# EAGLE design posboard (EAGLE 7.1.0)
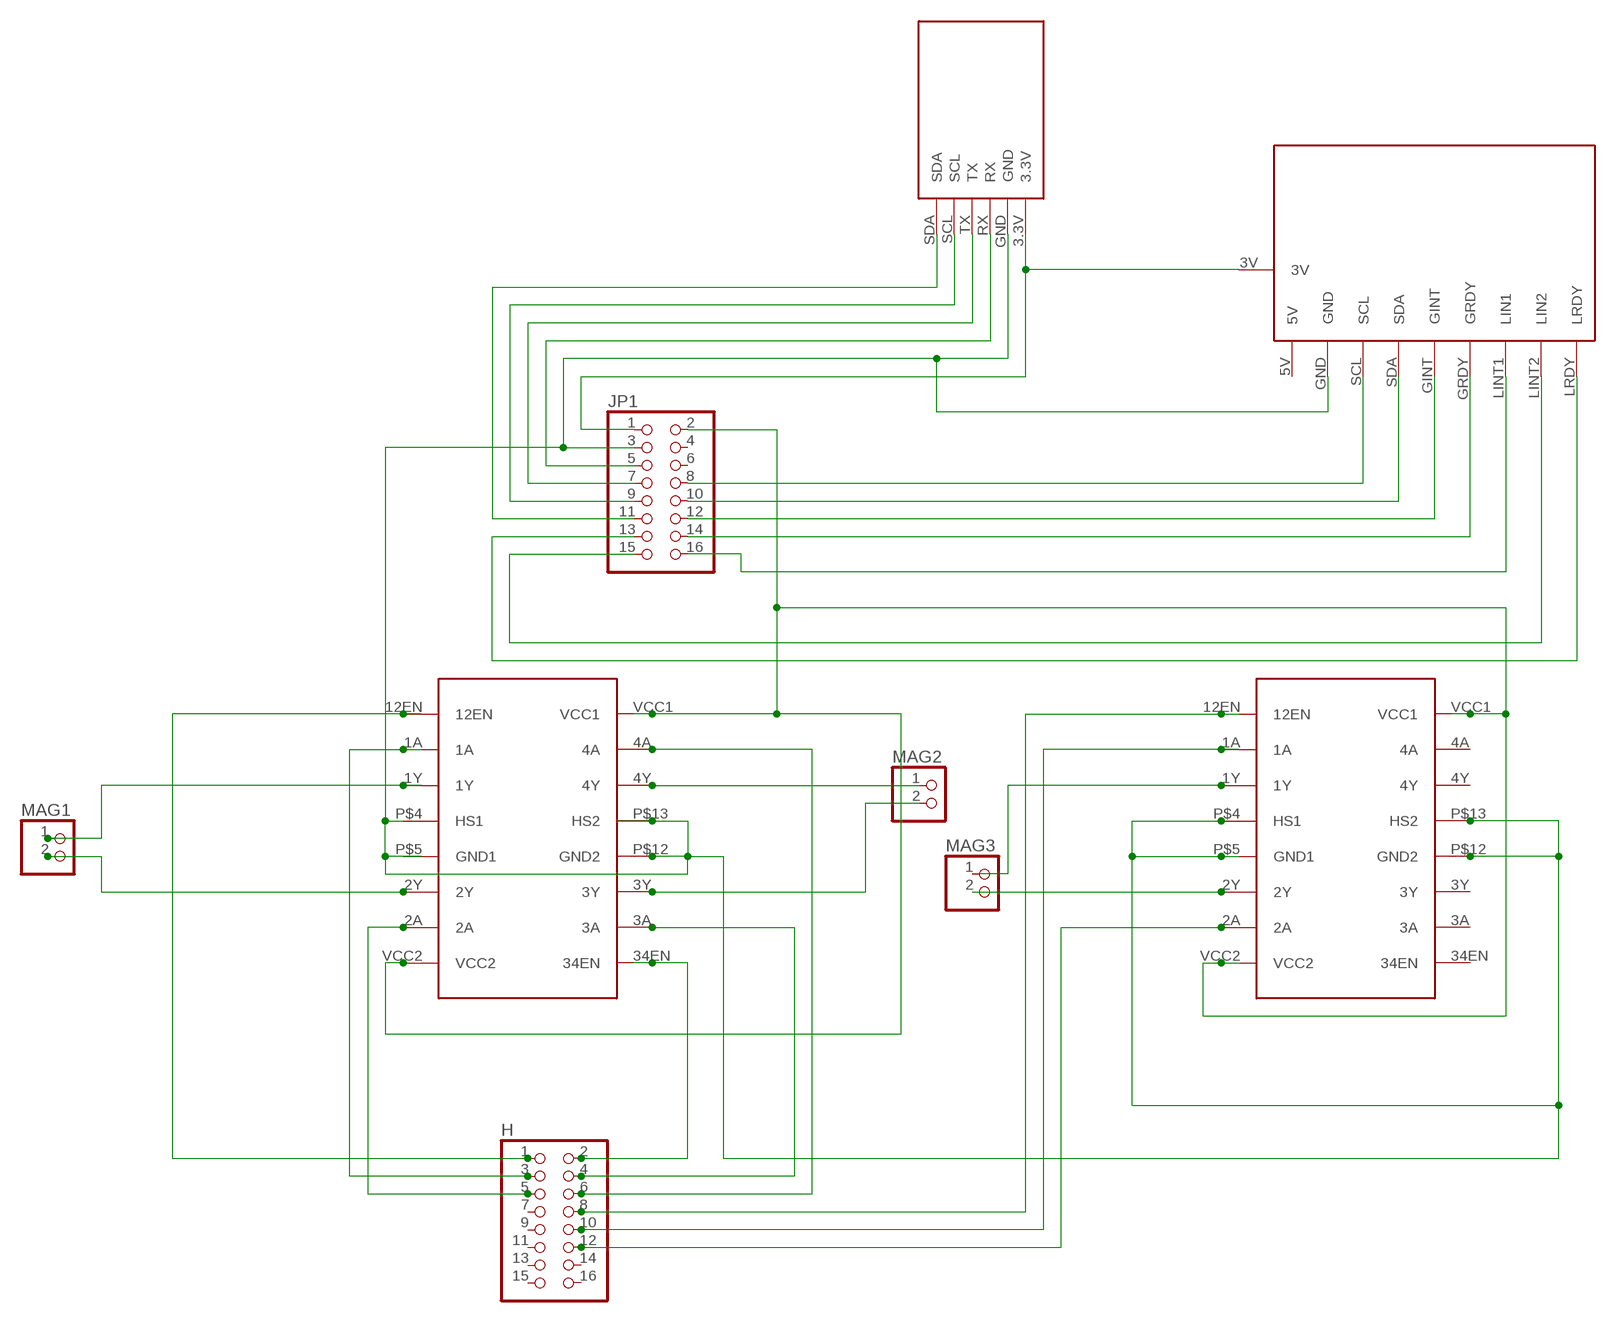
[diagram p0: schematic, sheet 1]

## Parts
H  PINHD-2X8  [2X08]
JP1  PINHD-2X8  [2X08]
MAG1  PINHD-1X2  [1X02]
MAG2  PINHD-1X2  [1X02]
MAG3  PINHD-1X2  [1X02]
U$1  GPS  [GPS]
U$2  IMU  [IMU]
U$3  HBRIDGE  [HBRIDGE]
U$4  HBRIDGE  [HBRIDGE]

## Nets
N$1: JP1.1 U$1.3.3V U$2.3V
N$2: JP1.3 U$1.GND U$2.GND U$3.P$4(HS1) U$3.P$12(GND2) U$3.P$13(HS2) U$4.P$4(HS1) U$4.P$5(GND1) U$4.P$12(GND2) U$4.P$13(HS2)
N$3: JP1.5 U$1.RX
N$4: JP1.7 U$1.TX
N$5: JP1.9 U$1.SCL
N$6: JP1.11 U$1.SDA
N$7: H.1 U$3.12EN
N$8: JP1.13 U$2.LRDY
N$9: JP1.15 U$2.LINT2(LIN2)
N$10: JP1.16 U$2.LINT1(LIN1)
N$11: JP1.14 U$2.GRDY
N$12: JP1.12 U$2.GINT
N$13: JP1.10 U$2.SDA
N$14: JP1.8 U$2.SCL
N$15: H.3 U$3.1A
N$16: JP1.2 U$3.VCC1 U$3.VCC2 U$4.VCC1 U$4.VCC2
N$17: H.2 U$3.34EN
N$18: H.4 U$3.3A
N$19: H.5 U$3.2A
N$20: H.8 U$4.12EN
N$21: H.10 U$4.1A
N$22: H.6 U$3.4A
N$23: H.12 U$4.2A
N$24: MAG1.1 U$3.1Y
N$25: MAG1.2 U$3.2Y
N$26: MAG2.1 U$3.4Y
N$27: MAG2.2 U$3.3Y
N$28: MAG3.1 U$4.1Y
N$29: MAG3.2 U$4.2Y
Unconnected: H.7 H.9 H.11 H.13 H.14 H.15 H.16 JP1.4 JP1.6 U$2.5V U$3.P$5(GND1) U$4.3A U$4.3Y U$4.4A U$4.4Y U$4.34EN

## Library data of the parts
H JP1 = pinhead:PINHD-2X8: PIN HEADER
MAG1-MAG3 = pinhead:PINHD-1X2: PIN HEADER
U$1 = gps:GPS
U$2 = imu:IMU
U$3 U$4 = hbridge:HBRIDGE

## Board
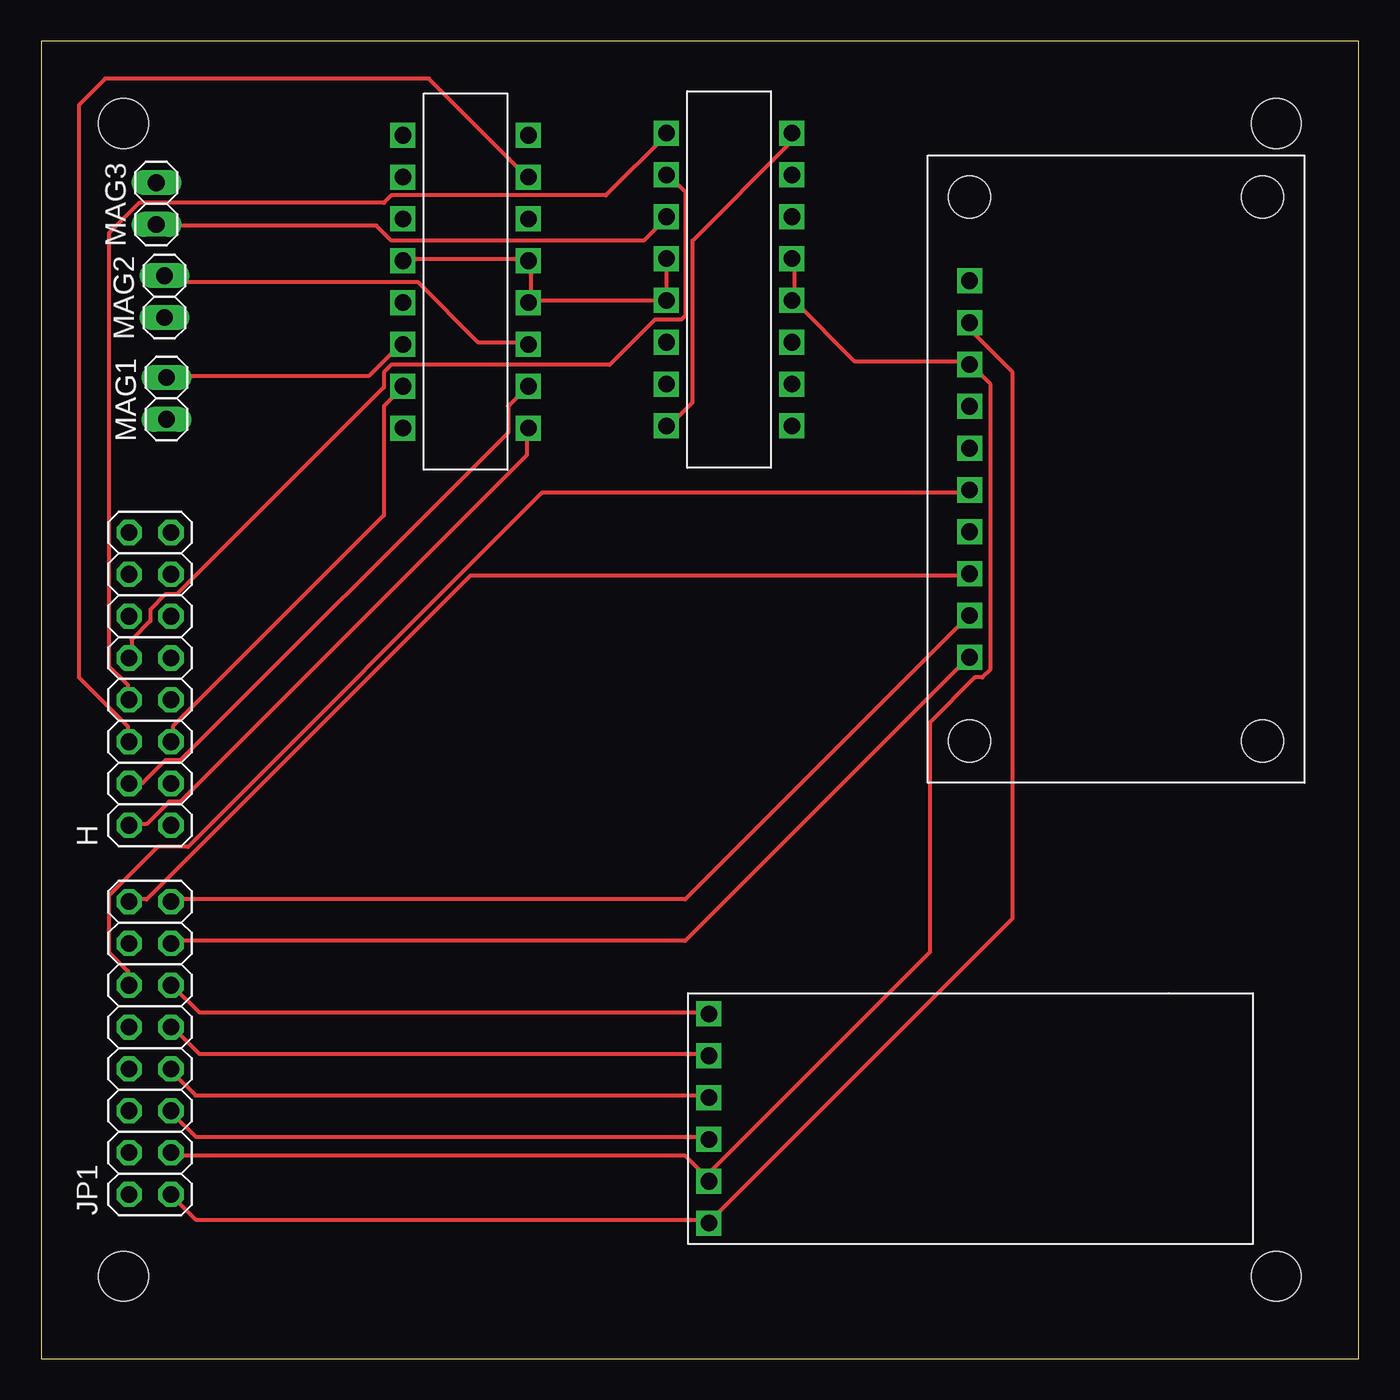
[diagram p1: board, top side]
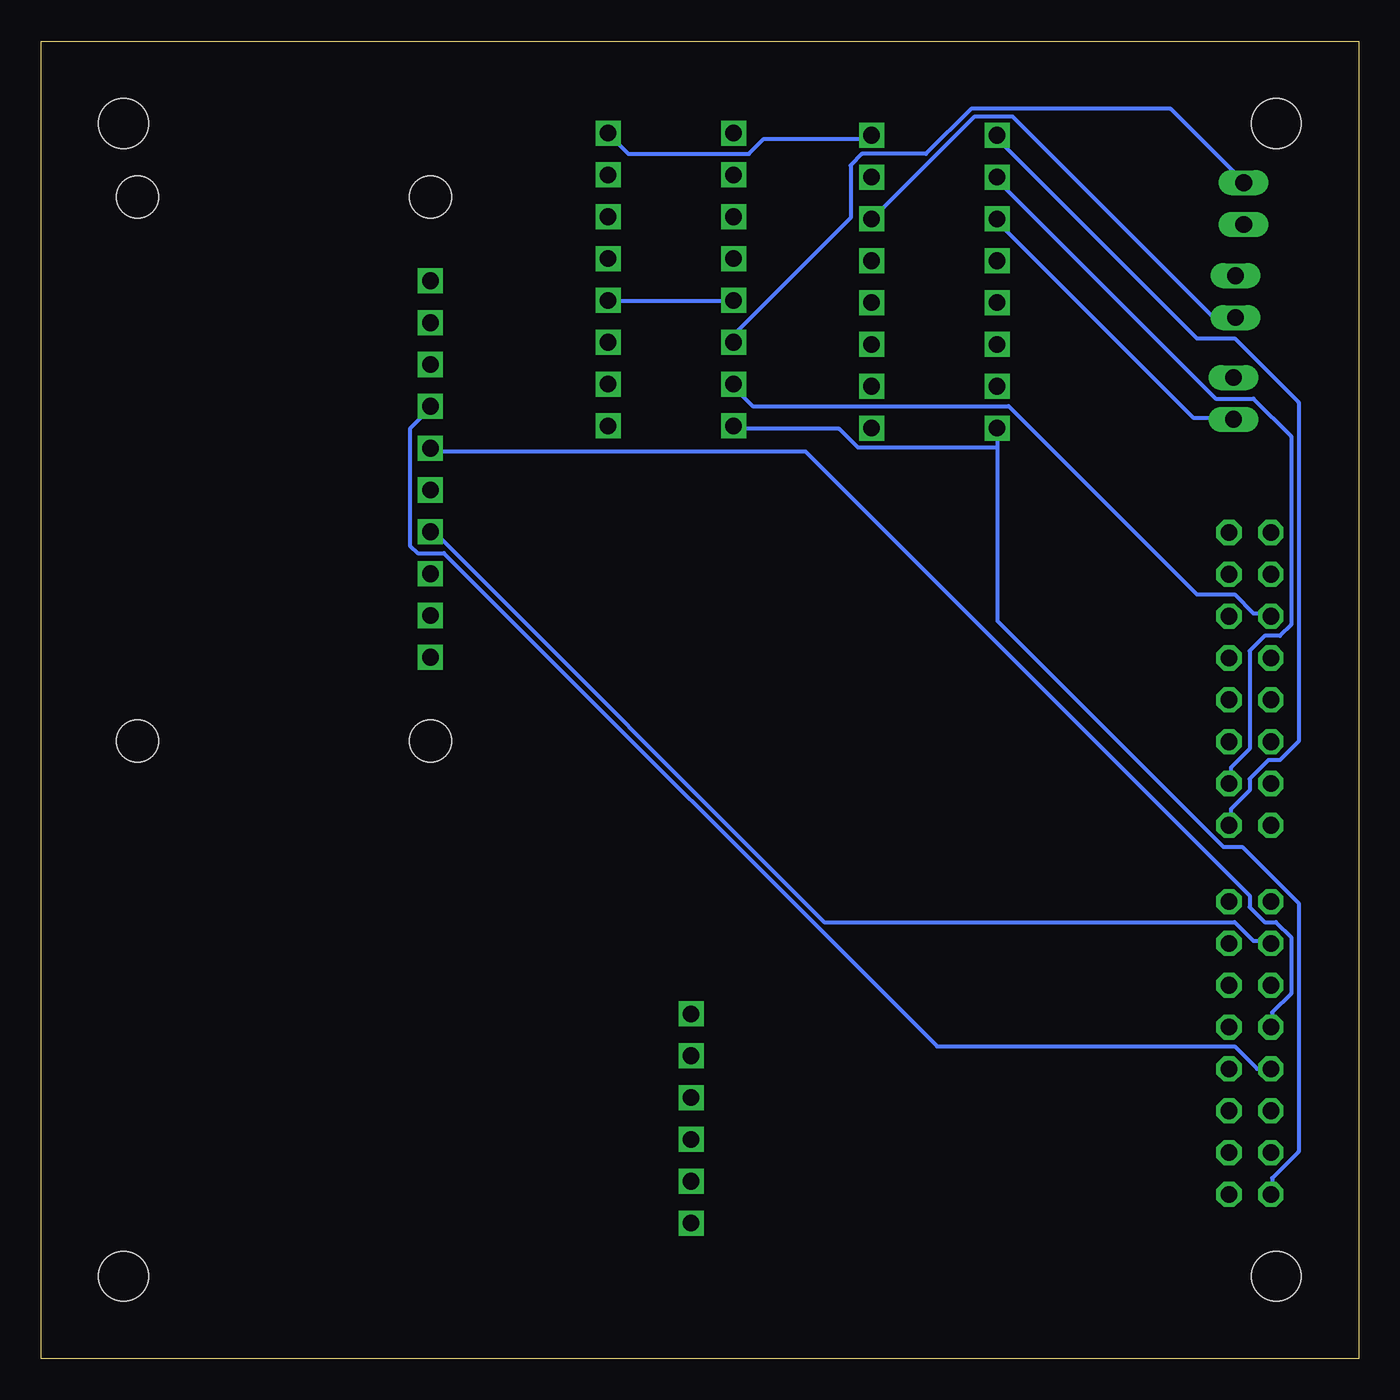
[diagram p2: board, bottom side, seen from below]

Size 80 x 80 mm. Coordinates in mm from the lower left corner, seen from the top.
Outline: 0,0 80,0 80,80 0,80 0,0
Copper layers (1*16): Top 0.035mm / dielectric 1.5mm / Bottom 0.035mm
Design rules "default": minimum track width 10mil, minimum drill 24mil, track to track 8mil, track to pad 8mil, pad to pad 8mil, via to via 8mil, smd to smd 8mil, copper to edge 40mil, drill to drill 8mil, minimum pad ring 10mil, minimum via ring 8mil, stop-mask expansion 4mil, vias tented up to drill 0mil, thermal gap 10mil
Holes 3 mm at 5,75 75,75 75,5 5,5

### Footprints (pad centres in the part's own frame; a part is rotated, then mirrored left to right if it is on the bottom)
2X08 = drill 1.016 octagon: 1 -8.89,-1.27; 2 -8.89,1.27; 3 -6.35,-1.27; 4 -6.35,1.27; 5 -3.81,-1.27; 6 -3.81,1.27; 7 -1.27,-1.27; 8 -1.27,1.27; 9 1.27,-1.27; 10 1.27,1.27; 11 3.81,-1.27; 12 3.81,1.27; 13 6.35,-1.27; 14 6.35,1.27; 15 8.89,-1.27; 16 8.89,1.27
1X02 = drill 1.016 long: 1 -1.27,0; 2 1.27,0
GPS = drill 1.016 square: 3.3V 15.24,1.27; GND 12.7,1.27; RX 10.16,1.27; SCL 5.08,1.27; SDA 2.54,1.27; TX 7.62,1.27
IMU = drill 1.016 square: 3V 10.16,2.54; 5V 7.62,2.54; GINT 20.32,2.54; GND 12.7,2.54; GRDY 22.86,2.54; LINT1 25.4,2.54; LINT2 27.94,2.54; LRDY 30.48,2.54; SCL 15.24,2.54; SDA 17.78,2.54 | hole 2.54: 2.54,2.54; 35.56,2.54; 2.54,20.32; 35.56,20.32
HBRIDGE = drill 1.016 square: 1A -3.81,-2.54; 1Y -1.27,-2.54; 2A 8.89,-2.54; 2Y 6.35,-2.54; 3A 8.89,5.08; 3Y 6.35,5.08; 4A -3.81,5.08; 4Y -1.27,5.08; 12EN -6.35,-2.54; 34EN 11.43,5.08; P$4 1.27,-2.54; P$5 3.81,-2.54; P$12 1.27,5.08; P$13 3.81,5.08; VCC1 -6.35,5.08; VCC2 11.43,-2.54

### Placement (x,y rotation side)
H  6.61,41.28 90 top
JP1  6.61,18.87 90 top
MAG1  7.61,58.31 90 top
MAG2  7.49,64.49 90 top
MAG3  6.99,70.14 90 top
U$1  39.27,23.48 270 top
U$2  53.83,73.07 270 top
U$3  24.5,67.94 270 top
U$4  40.5,68.07 270 top

### Tracks (layer width: path | path; a pad name or v marks a point on that pad's centre or on a via)
N$1
  Top 0.254: JP1.1 8,9.83 9.37,8.46 40.46,8.46 U$1.3.3V 40.69,8.46 58.98,26.75 58.98,59.89 56.46,62.41 56.46,62.87 U$2.3V
N$2
  Top 0.254: JP1.3 8,12.34 39.09,12.34 40.46,10.97 U$1.GND 40.69,10.97 40.69,11.43 53.95,24.69 53.95,38.63 56.69,41.38 57.15,41.38 57.61,41.83 57.61,59.21 56.46,60.35 U$2.GND 56.24,60.58 49.38,60.58 45.72,64.24 U$4.P$13 45.72,64.47 45.72,66.75 U$4.P$12 | 29.72,64.24 29.72,66.52 U$3.P$12 29.49,66.75 22.17,66.75 U$3.P$4 | U$4.P$4 37.95,66.75 37.95,64.47 U$4.P$5 37.95,64.24 29.72,64.24 | 29.72,64.24 U$3.P$13
  Bottom 0.254: U$4.P$5 38.18,64.24 45.49,64.24 U$4.P$13
N$3
  Top 0.254: U$1.RX 40.46,13.49 9.37,13.49 8,14.86 JP1.5
N$4
  Top 0.254: U$1.TX 40.46,16 9.37,16 8,17.37 JP1.7
N$5
  Top 0.254: U$1.SCL 40.46,18.52 9.6,18.52 8,20.12 JP1.9
N$6
  Top 0.254: U$1.SDA 40.46,21.03 9.6,21.03 8,22.63 JP1.11
N$7
  Bottom 0.254: H.1 7.77,32.46 7.77,33.38 6.63,34.52 6.63,35.2 5.49,36.35 4.8,36.35 3.66,37.49 3.66,58.06 7.54,61.95 9.83,61.95 21.95,74.07 U$3.12EN
N$8
  Top 0.254: JP1.13 8,25.38 39.09,25.38 56.24,42.52 U$2.LRDY
N$9
  Top 0.254: JP1.15 8,27.89 39.09,27.89 56.24,45.03 U$2.LINT2
N$10
  Top 0.254: JP1.16 5.49,27.89 6.4,27.89 26.06,47.55 56.24,47.55 U$2.LINT1
N$11
  Bottom 0.254: JP1.14 5.49,25.38 6.4,25.38 7.54,26.52 32.46,26.52 56.24,50.29 U$2.GRDY
N$12
  Top 0.254: JP1.12 5.26,22.86 5.26,23.55 4.12,24.69 4.12,28.12 7.09,31.09 8.91,31.09 30.4,52.58 56.24,52.58 U$2.GINT
N$13
  Bottom 0.254: JP1.10 5.26,20.34 5.26,21.03 4.12,22.17 4.12,25.6 5.03,26.52 5.71,26.52 6.63,27.43 6.63,28.12 33.6,55.09 56.24,55.09 U$2.SDA
N$14
  Bottom 0.254: JP1.8 5.49,17.6 6.17,17.6 7.54,18.97 25.6,18.97 55.55,48.92 57.15,48.92 57.61,49.38 57.61,56.46 56.46,57.61 U$2.SCL
N$15
  Bottom 0.254: H.3 7.77,34.98 7.77,35.89 6.63,37.03 6.63,42.98 5.71,43.89 4.8,43.89 4.12,44.58 4.12,56.01 6.4,58.29 8.69,58.29 21.95,71.55 U$3.1A
N$16
  Top 0.254: U$4.VCC1 45.49,74.3 45.49,73.84 39.55,67.89 39.55,58.06 38.18,56.69 U$4.VCC2
  Bottom 0.254: U$3.VCC1 29.72,74.07 36.12,74.07 37.03,73.15 44.35,73.15 45.49,74.3 U$4.VCC1 | 21.95,55.32 21.95,56.46 U$3.VCC2 | 21.95,55.32 21.95,44.81 8.23,31.09 7.09,31.09 3.66,27.66 3.66,12.57 5.26,10.97 5.26,10.06 JP1.2 | 21.95,55.32 30.4,55.32 31.55,56.46 37.95,56.46 U$4.VCC2
N$17
  Top 0.254: H.2 5.49,32.46 6.4,32.46 7.77,33.83 8.46,33.83 29.49,54.86 29.49,56.46 U$3.34EN
N$18
  Top 0.254: H.4 5.49,34.98 6.17,34.98 7.54,36.35 8.46,36.35 28.35,56.24 28.35,57.84 29.49,58.98 U$3.3A
N$19
  Top 0.254: H.5 8,37.49 8,38.41 20.8,51.21 20.8,57.84 21.95,58.98 U$3.2A
N$20
  Top 0.254: H.8 5.26,40.23 5.26,40.92 4.12,42.06 4.12,68.35 5.94,70.18 20.8,70.18 21.26,70.64 34.29,70.64 37.95,74.3 U$4.12EN
N$21
  Top 0.254: H.10 5.49,42.75 5.49,43.66 6.63,44.81 6.63,45.49 7.54,46.41 8.23,46.41 20.8,58.98 20.8,59.89 21.26,60.35 34.52,60.35 37.26,63.09 38.86,63.09 39.09,63.32 39.09,70.87 38.18,71.78 U$4.1A
N$22
  Top 0.254: H.6 5.26,37.49 5.26,38.41 2.29,41.38 2.29,76.12 3.89,77.72 23.55,77.72 29.49,71.78 U$3.4A
N$23
  Bottom 0.254: H.12 5.49,45.26 6.4,45.26 7.54,46.41 9.83,46.41 21.26,57.84 36.8,57.84 37.95,58.98 U$4.2A
N$24
  Bottom 0.254: MAG1.1 7.77,57.15 10.06,57.15 21.95,69.04 U$3.1Y
N$25
  Top 0.254: MAG1.2 7.77,59.66 19.89,59.66 21.95,61.72 U$3.2Y
N$26
  Bottom 0.254: MAG2.1 7.54,63.32 8.91,63.32 21.03,75.44 23.32,75.44 29.49,69.27 U$3.4Y
N$27
  Top 0.254: U$3.3Y 29.49,61.72 26.52,61.72 22.86,65.38 7.77,65.38 7.54,65.61 MAG2.2
N$28
  Top 0.254: MAG3.1 7.09,68.81 20.34,68.81 21.26,67.89 36.58,67.89 37.95,69.27 U$4.1Y
N$29
  Bottom 0.254: U$4.2Y 37.95,61.72 37.95,62.18 30.86,69.27 30.86,72.47 30.18,73.15 26.29,73.15 23.55,75.89 11.43,75.89 7.09,71.55 MAG3.2